# Altium schematic sheet POWER.SchDoc
size A; SheetNumber: 2; SheetTotal: 5
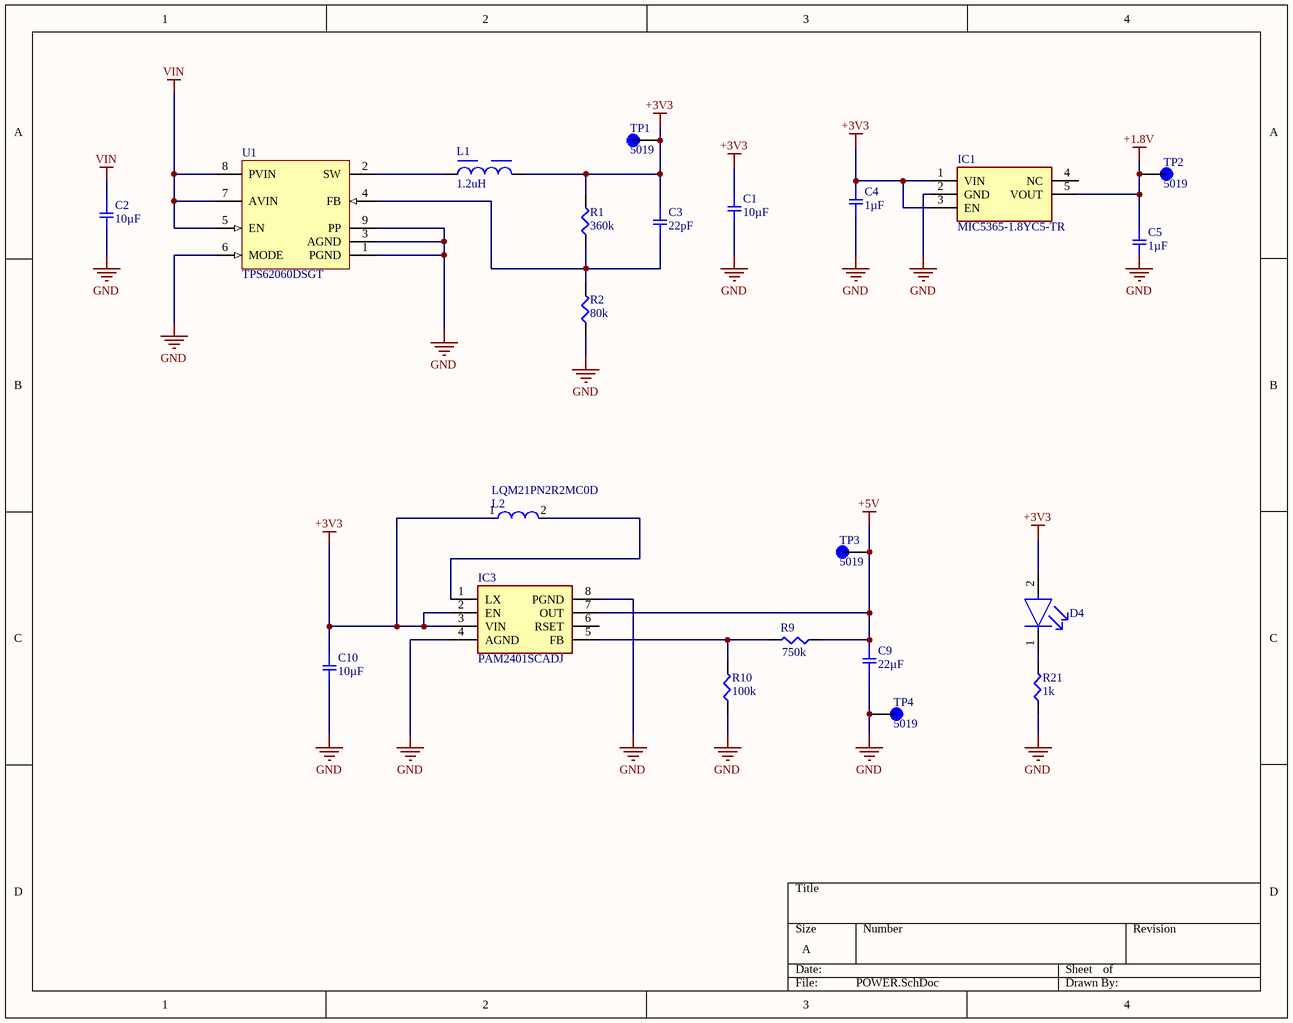
[diagram p0: POWER.SchDoc]

## Parts
C1  10µF  [SMD-0603C]
C2  10µF  [SMD-0603C]
C3  22pF  [SMD-0402C]
C4  1µF  [SMD-0402C]
C5  1µF  [SMD-0402C]
C9  22µF  [SMD-0603C]
C10  10µF  [SMD-0603C]
D4  APHHS1005CGCK  [FP-APHHS1005CGCK-MFG]  (value not drawn)
IC1  MIC5365-1.8YC5-TR  [SOT65P210X110-5N]
IC3  PAM2401SCADJ  [SOP65P490X110-8N]
L1  1.2uH  [WE-MAIA_1610]
L2  LQM21PN2R2MC0D  [FP-LQM21PN_C0-IPC_A]
R1  360k  [SMD-0402-RES]
R2  80k  [SMD-0402-RES]
R9  750k  [SMD-0402-RES]
R10  100k  [SMD-0402-RES]
R21  1k  [SMD-0402-RES]
TP1  5019  [KEYSTONE_5019]
TP2  5019  [KEYSTONE_5019]
TP3  5019  [KEYSTONE_5019]
TP4  5019  [KEYSTONE_5019]
U1  TPS62060DSGT  [DSG0008A_V]

## Nets
+1.8V: C5.1 IC1.5(VOUT) TP2.TP
+3V3: C1.1 C3.1 C4.1 C10.1 D4.2(A) IC1.1(VIN) IC1.3(EN) IC3.2(EN) IC3.3(VIN) L1.2 L2.1 R1.2 TP1.TP
+5V: C9.1 IC3.7(OUT) R9.1 TP3.TP
GND: C1.2 C2.2 C4.2 C5.2 C9.2 C10.2 IC1.2(GND) IC3.4(AGND) IC3.8(PGND) R2.1 R10.1 R21.1 TP4.TP U1.1(PGND) U1.3(AGND) U1.6(MODE) U1.9(PP)
VIN: C2.1 U1.5(EN) U1.7(AVIN) U1.8(PVIN)
NetC3_2: C3.2 R1.1 R2.2 U1.4(FB)
NetD4_1: D4.1(C) R21.2
NetIC3_1: IC3.1(LX) L2.2
NetIC3_5: IC3.5(FB) R9.2 R10.2
NetL1_1: L1.1 U1.2(SW)

Not connected (* = marked no-connect by the designer): IC1 4(NC); IC3 6(RSET)

## Library data of the parts
C1 C2 C10 = GRM188C81C106MA73D: CAP CER 10UF 16V X6S 0603; Manufacturer: Murata Electronics North America; Factory Stock: 0; Unit Price (USD): 0.34; Minimum Quantity: 1; Tolerance: ±20%; Datasheets: http://www.murata.com/~/media/webrenewal/support/library/catalog/products/capacitor/mlcc/c02e.pdf; Image: //media.digikey.com/Renders/Murata%20Renders/ZRB-SERIES-0402.jpg; Digi-Key Part Number: 490-7198-1-ND; Part Number: GRM188C81C106MA73D; Quantity Available: 215049; @ qty: 0; Packaging: Cut Tape (CT); Series: GRM; Part Status: Active; Value: 10µF; Voltage: 16V; Temperature Coefficient: X6S; Operating Temperature: -55°C ~ 105°C; Features: -; Ratings: -; Applications: General Purpose; Mounting Type: Surface Mount, MLCC; Package / Case: 0603 (1608 Metric); Size / Dimension: 0.063" L x 0.031" W (1.60mm x 0.80mm); Height - Seated (Max): -; Thickness (Max): 0.031" (0.80mm); Lead Spacing: -; Lead Style: -
C3 = GCM1555C1H220JA16D: CAP CER 22PF 50V NP0 0402; Manufacturer: Murata Electronics North America; Factory Stock: 0; Unit Price (USD): 0.1; Minimum Quantity: 1; Tolerance: ±5%; Temperature Coefficient: C0G, NP0; Datasheets: http://www.murata.com/~/media/webrenewal/support/library/catalog/products/capacitor/mlcc/c03e.ashx; Image: //media.digikey.com/Renders/Murata%20Renders/ZRB-SERIES-0402.jpg; Digi-Key Part Number: 490-9648-1-ND; Part Number: GCM1555C1H220JA16D; Quantity Available: 26532; @ qty: 0; Packaging: Cut Tape (CT); Series: GCM; Part Status: Active; Value: 22pF; Voltage: 50V; Operating Temperature: -55°C ~ 125°C; Features: -; Ratings: AEC-Q200; Applications: Automotive; Mounting Type: Surface Mount, MLCC; Package / Case: 0402 (1005 Metric); Size / Dimension: 0.039" L x 0.020" W (1.00mm x 0.50mm); Height - Seated (Max): -; Thickness (Max): 0.022" (0.55mm); Lead Spacing: -; Lead Style: -
C4 C5 = GCM155C71A105KE38D: CAP CER 1UF 10V X7S 0402; Manufacturer: Murata Electronics North America; Factory Stock: 0; Unit Price (USD): 0.12; Minimum Quantity: 1; Tolerance: ±10%; Datasheets: http://www.murata.com/~/media/webrenewal/support/library/catalog/products/capacitor/mlcc/c03e.ashx; Image: //media.digikey.com/Renders/Murata%20Renders/ZRB-SERIES-0402.jpg; Digi-Key Part Number: 490-13409-1-ND; Part Number: GCM155C71A105KE38D; Quantity Available: 7240; @ qty: 0; Packaging: Cut Tape (CT); Series: GCM; Part Status: Active; Value: 1µF; Voltage: 10V; Temperature Coefficient: X7S; Operating Temperature: -55°C ~ 125°C; Features: -; Ratings: AEC-Q200; Applications: Automotive; Mounting Type: Surface Mount, MLCC; Package / Case: 0402 (1005 Metric); Size / Dimension: 0.039" L x 0.020" W (1.00mm x 0.50mm); Height - Seated (Max): -; Thickness (Max): 0.022" (0.55mm); Lead Spacing: -; Lead Style: -
C9 = GRM188C60J226MEA0D: CAP CER 22UF 6.3V X5S 0603; Manufacturer: Murata Electronics North America; Factory Stock: 0; Unit Price (USD): 0.27; Minimum Quantity: 1; Tolerance: ±20%; Datasheets: http://www.murata.com/~/media/webrenewal/support/library/catalog/products/capacitor/mlcc/c02e.pdf; Image: //media.digikey.com/Renders/Murata%20Renders/ZRB-SERIES-0402.jpg; Digi-Key Part Number: 490-10468-1-ND; Part Number: GRM188C60J226MEA0D; Quantity Available: 3653; @ qty: 0; Packaging: Cut Tape (CT); Series: GRM; Part Status: Active; Value: 22µF; Voltage: 6.3V; Temperature Coefficient: X5S; Operating Temperature: -55°C ~ 85°C; Features: Derating Recommended; Ratings: -; Applications: General Purpose; Mounting Type: Surface Mount, MLCC; Package / Case: 0603 (1608 Metric); Size / Dimension: 0.063" L x 0.031" W (1.60mm x 0.80mm); Height - Seated (Max): -; Thickness (Max): 0.039" (1.00mm); Lead Spacing: -; Lead Style: -
D4 = CMP-44529-000044-1: LED GREEN CLEAR CHIP SMD; Viewing Angle: 120°; Dominant Wavelength: 570nm; Test Current: 20mA; Luminous Intensity: 50mcd; Forward Voltage: 2.1V; Number of LEDs: 1; Lens Color: Clear; Packaging: Tape and Reel; Max Operating Temperature: 85°C; Illumination Color: Green; Length: 1mm; Mount: Surface Mount; Lens Style: Clear; Color: Green; Number of Pins: 2; Wavelength: 570nm; Case/Package: 0402; Width: 0.5mm; Package Quantity: 2000; Case Code (Metric): 1005; Height: 0.6mm; Lead Free: Lead Free; Case Code (Imperial): 0402; Forward Current: 20mA; Min Operating Temperature: -40°C
IC1 = MIC5365-1.8YC5-TR: Integrated Circuit; Manufacturer_Name: Microchip; Datasheet Link: http://ww1.microchip.com/downloads/en/DeviceDoc/mic5365.pdf; Height: 1.1mm; Manufacturer_Part_Number: MIC5365-1.8YC5-TR; Mouser Part Number: 998-MIC5365-1.8YC5TR; Mouser Price/Stock: https://www.mouser.co.uk/ProductDetail/Microchip-Technology/MIC5365-1.8YC5-TR?qs=U6T8BxXiZAUJRWmX5wGIlA%3D%3D; Arrow Part Number: MIC5365-1.8YC5-TR; Arrow Price/Stock: https://www.arrow.com/en/products/mic5365-1.8yc5-tr/microchip-technology?utm_currency=USD&region=nac
IC3 = PAM2401SCADJ: Integrated Circuit; Manufacturer_Name: Diodes Incorporated; Datasheet Link: https://www.diodes.com//assets/Datasheets/PAM2401.pdf; Height: 1.1mm; Manufacturer_Part_Number: PAM2401SCADJ; Mouser Part Number: 621-PAM2401SCADJ; Mouser Price/Stock: https://www.mouser.co.uk/ProductDetail/Diodes-Incorporated/PAM2401SCADJ?qs=Ay79KZaUeZCprHtLIDXq%252BQ%3D%3D; Arrow Part Number: PAM2401SCADJ; Arrow Price/Stock: https://www.arrow.com/en/products/pam2401scadj/diodes-incorporated?region=nac
L1 = CMP-03913-119894041-2: 78438313012 Power Inductor, Aec-Q200, 1.2Uh, 1.3A Rohs Compliant: Yes; DC Resistance (DCR): 140mΩ; Inductance: 1.2µH; Ambient Temperature Range High: 85°C; Height: 1mm; Current Rating: 1.3A; Max Operating Temperature: 125°C; Min Operating Temperature: -40°C; Length: 1.6mm; NexarPartId: 119894041; RoHS: Compliant; Ambient Temperature Range Low: -40°C; Width: 1.6mm
L2 = CMP-06042-016994-1: Multilayer Type Inductor for Power Lines, 0805 (2012), 2.2μH, 20%, 0.425Ω, 0.6A; Test Frequency: 1MHz; Inductance: 2.2uH; Max DC Current: 600mA; Core Material: Ferrite; DC Resistance (DCR): 340mR; Shielding: Shielded; Self Resonant Frequency: 50MHz; RoHS Compliant: Yes; Height: 0.5mm; Mount: Surface Mount; REACH SVHC: No SVHC; Width: 0.049inch; Military Standard: Not; Max Operating Temperature: 125°C; Lead Free: Lead Free; Tolerance: 20%; Series: LQM21PN_CO; Case Code (Imperial): 0805; Case Code (Metric): 2012; Length: 2mm; Package Quantity: 4000; Radiation Hardening: No; Termination: SMD/SMT; Inductance Tolerance: 20%; Rated Current-Max: 600mA; Current Rating: 600mA; Min Operating Temperature: -55°C; Case/Package: 0805; Height - Seated (Max): 0.022inch; Depth: 1.45mm; Packaging: Tape and Reel; DC Current: 600mA
R1 R2 = ERJ-2GEJ364X: RES SMD 360K OHM 5% 1/10W 0402; Manufacturer: Panasonic Electronic Components; Factory Stock: 0; Unit Price (USD): 0.00350; @ qty: 1500; Minimum Quantity: 1; Power (Watts): 0.1W, 1/10W; Temperature Coefficient: ±200ppm/°C; Part Number: ERJ-2GEJ364X; Datasheets: http://industrial.panasonic.com/www-cgi/jvcr13pz.cgi?E+PZ+3+AOA0001+ERJ2GEJ364X+7+WW; Image: //media.digikey.com/Photos/Panasonic%20Photos/ERJ-PA2-Series.jpg; Digi-Key Part Number: P360KJCT-ND; Quantity Available: 75680; Packaging: Cut Tape (CT); Series: ERJ; Part Status: Active; Value: 360k; Tolerance: ±5%; Composition: Thick Film; Features: Automotive AEC-Q200; Operating Temperature: -55°C ~ 155°C; Package / Case: 0402 (1005 Metric); Supplier Device Package: 0402; Size / Dimension: 0.039" L x 0.020" W (1.00mm x 0.50mm); Height - Seated (Max): 0.016" (0.40mm); Number of Terminations: 2; Failure Rate: -
R9 = ERJ-2RKF7503X: RES SMD 750K OHM 1% 1/10W 0402; Manufacturer: Panasonic Electronic Components; Factory Stock: 0; Unit Price (USD): 0.00496; @ qty: 1500; Minimum Quantity: 1; Power (Watts): 0.1W, 1/10W; Temperature Coefficient: ±100ppm/°C; Part Number: ERJ-2RKF7503X; Datasheets: http://industrial.panasonic.com/www-cgi/jvcr13pz.cgi?E+PZ+3+AOA0002+ERJ2RKF7503X+7+WW; Image: //media.digikey.com/Photos/Panasonic%20Photos/ERJ-PA2-Series.jpg; Digi-Key Part Number: P750KLCT-ND; Quantity Available: 78807; Packaging: Cut Tape (CT); Series: ERJ; Part Status: Active; Value: 750k; Tolerance: ±1%; Composition: Thick Film; Features: Automotive AEC-Q200; Operating Temperature: -55°C ~ 155°C; Package / Case: 0402 (1005 Metric); Supplier Device Package: 0402; Size / Dimension: 0.039" L x 0.020" W (1.00mm x 0.50mm); Height - Seated (Max): 0.016" (0.40mm); Number of Terminations: 2; Failure Rate: -
R10 = ERJ-2GEJ104X: RES SMD 100K OHM 5% 1/10W 0402; Manufacturer: Panasonic Electronic Components; Factory Stock: 0; Unit Price (USD): 0.00350; @ qty: 1500; Minimum Quantity: 1; Power (Watts): 0.1W, 1/10W; Temperature Coefficient: ±200ppm/°C; Part Number: ERJ-2GEJ104X; Datasheets: http://industrial.panasonic.com/www-cgi/jvcr13pz.cgi?E+PZ+3+AOA0001+ERJ2GEJ104X+7+WW; Image: //media.digikey.com/Photos/Panasonic%20Photos/ERJ-PA2-Series.jpg; Digi-Key Part Number: P100KJCT-ND; Quantity Available: 2387986; Packaging: Cut Tape (CT); Series: ERJ; Part Status: Active; Value: 100k; Tolerance: ±5%; Composition: Thick Film; Features: Automotive AEC-Q200; Operating Temperature: -55°C ~ 155°C; Package / Case: 0402 (1005 Metric); Supplier Device Package: 0402; Size / Dimension: 0.039" L x 0.020" W (1.00mm x 0.50mm); Height - Seated (Max): 0.016" (0.40mm); Number of Terminations: 2; Failure Rate: -
R21 = ERJ-2GEJ102X: RES SMD 1K OHM 5% 1/10W 0402; Manufacturer: Panasonic Electronic Components; Factory Stock: 0; Unit Price (USD): 0.00350; @ qty: 1500; Minimum Quantity: 1; Power (Watts): 0.1W, 1/10W; Temperature Coefficient: ±200ppm/°C; Part Number: ERJ-2GEJ102X; Datasheets: http://industrial.panasonic.com/www-cgi/jvcr13pz.cgi?E+PZ+3+AOA0001+ERJ2GEJ102X+7+WW; Image: //media.digikey.com/Photos/Panasonic%20Photos/ERJ-PA2-Series.jpg; Digi-Key Part Number: P1.0KJCT-ND; Quantity Available: 1939857; Packaging: Cut Tape (CT); Series: ERJ; Part Status: Active; Value: 1k; Tolerance: ±5%; Composition: Thick Film; Features: Automotive AEC-Q200; Operating Temperature: -55°C ~ 155°C; Package / Case: 0402 (1005 Metric); Supplier Device Package: 0402; Size / Dimension: 0.039" L x 0.020" W (1.00mm x 0.50mm); Height - Seated (Max): 0.016" (0.40mm); Number of Terminations: 2; Failure Rate: -
TP1-TP4 = 5019: SMT Test Point- Mininature-1000 pc Reels; MF: Keystone Electronics; Value: *; MP: 5019; Availability: In Stock; Purchase-URL: https://pricing.snapeda.com/search/part/5019/?ref=eda; Package: None; Price: None
U1 = CMP-0323-00258-3: Buck Step Down Regulator with 2.7 to 6 V Input and 0.8 to 6 V Output, -40 to 85 degC, 8-Pin WSON (DSG), Green (RoHS & no Sb/Br); Manufacturer: Texas Instruments; Regulated Outputs(#): 1; Vout(Max)(V): 6; Synchronous Rectification: TRUE; Vin(Min)(V): 2.7; Rating: Catalog; Switch Current Limit(Typ)(A): 2.25; Iout(Max)(A): 1.6; Duty Cycle(Max)(%): 100; Iq(Typ)(mA): 0.018; Vout(Min)(V): 0.8; SubFamily: Step-Down Regulator; Eco-Plan: Green (RoHS & no Sb/Br); ComponentLink1URL: http://www.ti.com/general/docs/lit/getliterature.tsp?genericPartNumber=TPS62060&fileType=pdf; Topology: Buck; PackageReference: DSG0008A; ComponentLink2URL: http://www.ti.com/litv/pdf/mpds308a; PackageVersion: revB, Oct-2010; PartNumber: TPS62060DSGT; Mounting Technology: Surface Mount; Vin(Max)(V): 6; Code_JEDEC: MO-229; ComponentLink3URL: Samples URL:http://www.ti.com/product/tps54611#samples; PackageDescription: 8-Pin Plastic Small Outline No-Lead, 2 x 2 x 0.8 mm Body, 0.5 mm Pitch, Exposed Pad; ComponentLink3Description: URL Link1; ComponentLink2Description: Package Specification; DatasheetVersion: SLVSA95A; ComponentLink1Description: Datasheet